# EAGLE design NodeMCU_watering_system (EAGLE 8.2.0)
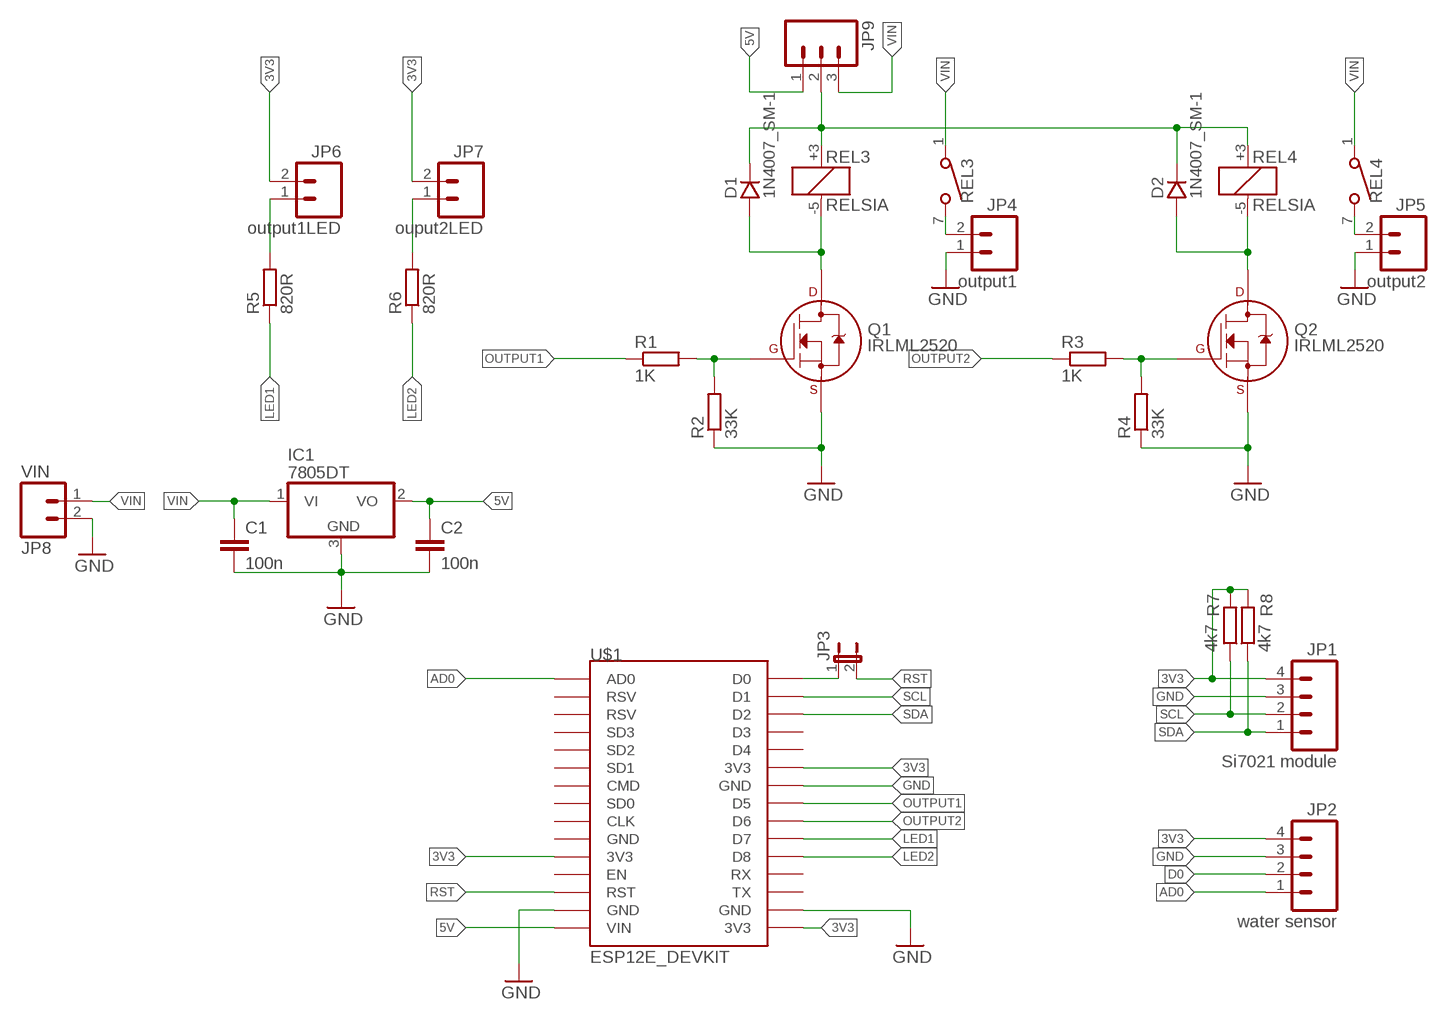
[diagram p0: schematic, sheet 1]

## Parts
C1  100n  C-EUC0805K  [C0805K]
C2  100n  C-EUC0805K  [C0805K]
D1  1N4007_SM-1  [SM-1]
D2  1N4007_SM-1  [SM-1]
IC1  7805DT  [TO252]
JP1  Si7021 module  M04LONGPADS  [1X04_LONGPADS]
JP2  water sensor  M04LONGPADS  [1X04_LONGPADS]
JP3  JP1E  [JP1]
JP4  output1  M02LOCK_LONGPADS  [1X02_LOCK_LONGPADS]
JP5  output2  M02LOCK_LONGPADS  [1X02_LOCK_LONGPADS]
JP6  output1LED  M02LOCK_LONGPADS  [1X02_LOCK_LONGPADS]
JP7  ouput2LED  M02LOCK_LONGPADS  [1X02_LOCK_LONGPADS]
JP8  VIN  M02LOCK_LONGPADS  [1X02_LOCK_LONGPADS]
JP9  M03LONGPADS  [1X03_LONGPADS]
Q1  IRLML2520  2N7002A_SOT23  [SOT-23]
Q2  IRLML2520  2N7002A_SOT23  [SOT-23]
R1  1K  R-EU_M0805  [M0805]
R2  33K  R-EU_M0805  [M0805]
R3  1K  R-EU_M0805  [M0805]
R4  33K  R-EU_M0805  [M0805]
R5  820R  R-EU_M0805  [M0805]
R6  820R  R-EU_M0805  [M0805]
R7  4k7  R-EU_M0805  [M0805]
R8  4k7  R-EU_M0805  [M0805]
REL3  RELSIA  [RELSIA]
REL4  RELSIA  [RELSIA]
U$1  ESP12E_DEVKIT  [ESP12E_DEVKIT]

## Nets
3V3: JP1.4 JP2.4 JP6.2 JP7.2 R7.2 R8.2 U$1.3V3@0(3V3) U$1.3V3@1(3V3) U$1.3V3@2(3V3)
5V: C2.1 IC1.2(VO) JP9.1 U$1.VIN
AD0: JP2.1 U$1.AD0
D0: JP2.2
GND: C1.2 C2.2 IC1.3(GND) JP1.3 JP2.3 JP4.1 JP5.1 JP8.2 Q1.2(S) Q2.2(S) R2.1 R4.1 U$1.GND@1(GND) U$1.GND@2(GND) U$1.GND@3(GND)
LED1: R5.1 U$1.D7
LED2: R6.1 U$1.D8
N$1: JP3.1 U$1.D0
N$2: Q1.1(G) R1.2 R2.2
N$3: Q2.1(G) R3.2 R4.2
N$4: D1.A Q1.3(D) REL3.-5(CIVKA:C-)
N$5: D2.A Q2.3(D) REL4.-5(CIVKA:C-)
N$6: JP4.2 REL3.7
N$7: JP5.2 REL4.7
N$8: JP6.1 R5.2
N$9: JP7.1 R6.2
N$10: D1.K D2.K JP9.2 REL3.+3(CIVKA:C+) REL4.+3(CIVKA:C+)
OUTPUT1: R1.1 U$1.D5
OUTPUT2: R3.1 U$1.D6
RST: JP3.2 U$1.RST
SCL: JP1.2 R7.1 U$1.D1
SDA: JP1.1 R8.1 U$1.D2
VIN: C1.1 IC1.1(VI) JP8.1 JP9.3 REL3.1 REL4.1
Unconnected: U$1.CLK U$1.CMD U$1.D3 U$1.D4 U$1.EN U$1.GND@0(GND) U$1.RSV@0(RSV) U$1.RSV@1(RSV) U$1.RX U$1.SD0 U$1.SD1 U$1.SD2 U$1.SD3 U$1.TX

## Library data of the parts
C1 C2 = rcl:C-EU: CAPACITOR, European symbol
D1 D2 = #PaJa_30:1N4007: Usmernovaci dioda - 1A, 1000V
IC1 = linear:78*: Positive VOLTAGE REGULATOR Source: http://cache.national.com/ds/LM/LM78L05.pdf http://www.fairchildsemi.com/ds/LM/LM7805.pdf
JP1 JP2 = SparkFun:M04: Header 4 Standard 4-pin 0.1" header. Use with straight break away headers (SKU : PRT-00116), right angle break away headers (PRT-00553), swiss pins (PRT-00743), machine pins (PRT-00117), and female headers (PRT-00115). Molex polarized connector foot print use with SKU : PRT-08231 with associated crimp pins and housings. 1MM SMD Version SKU: PRT-10208
JP3 = jumper:JP1E: JUMPER
JP4-JP8 = SparkFun:M02: Header 2 Standard 2-pin 0.1" header. Use with straight break away headers (SKU : PRT-00116), right angle break away headers (PRT-00553), swiss pins (PRT-00743), machine pins (PRT-00117), and female headers (PRT-00115). Molex polarized connector foot print use with SKU : PRT-08233 with associated crimp pins and housings.
JP9 = SparkFun:M03: Header 3 Standard 3-pin 0.1" header. Use with straight break away headers (SKU : PRT-00116), right angle break away headers (PRT-00553), swiss pins (PRT-00743), machine pins (PRT-00117), and female headers (PRT-00115). Molex polarized connector foot print use with SKU : PRT-08232 with associated crimp pins and housings.
Q1 Q2 = transistors:2N700*: 2N7000, 2N7002, NDS7002A N-channel enhancement mode MOSFET
R1-R8 = rcl:R-EU_: RESISTOR, European symbol
REL3 REL4 = #PaJa_22:RELSIA??: RELE - 1x spinaci, 5V, 12V, 24V max. spinany proud = 0,5A
U$1 = NodeMCU:ESP12E_DEVKIT: ESP12E DEVKIT BOARD

## Board
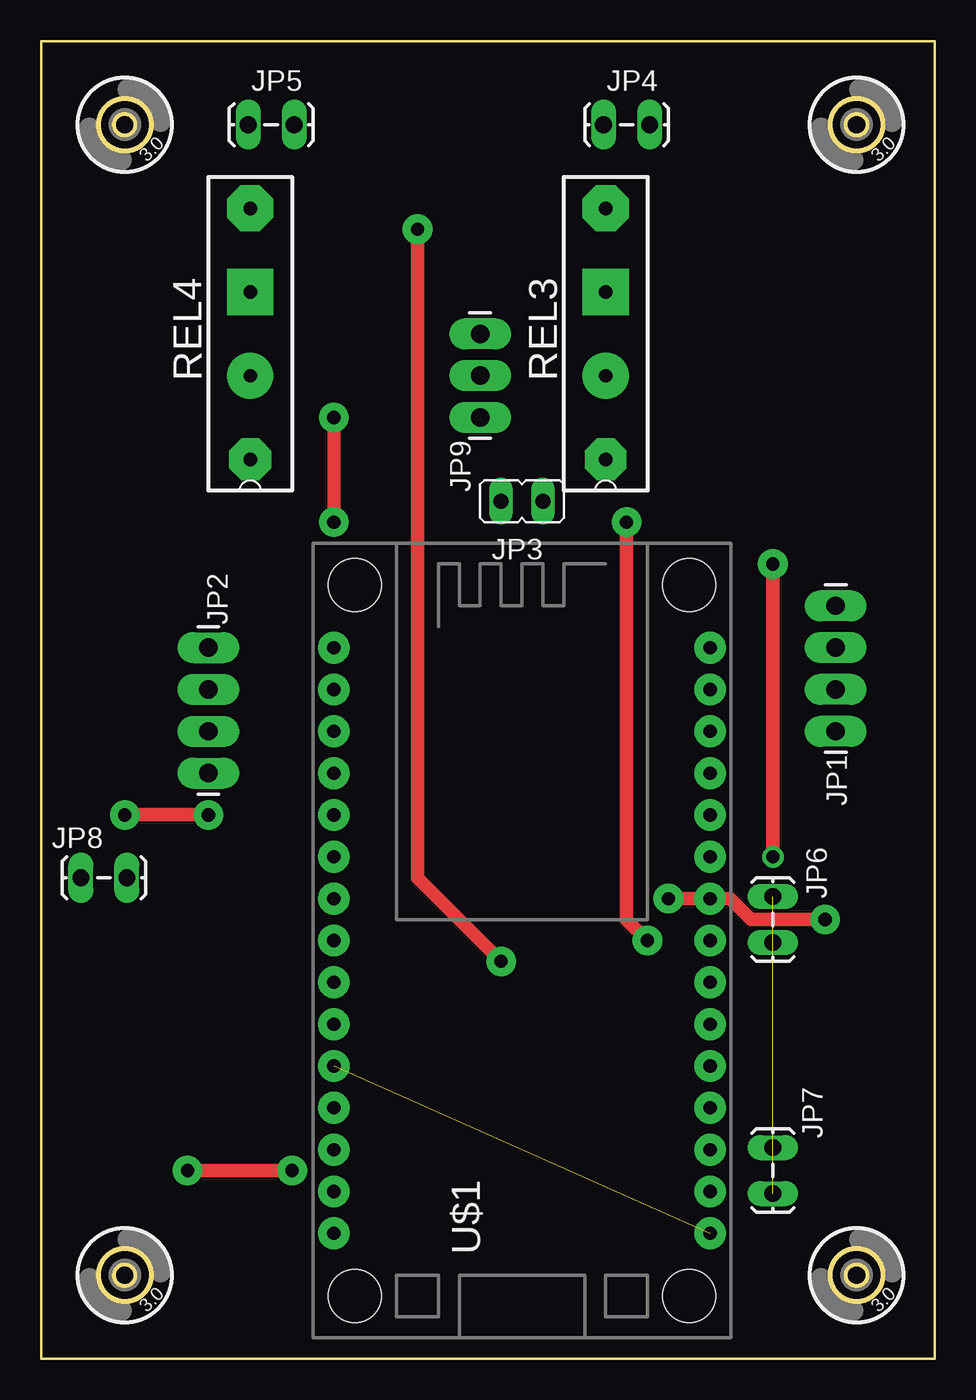
[diagram p1: board, top side]
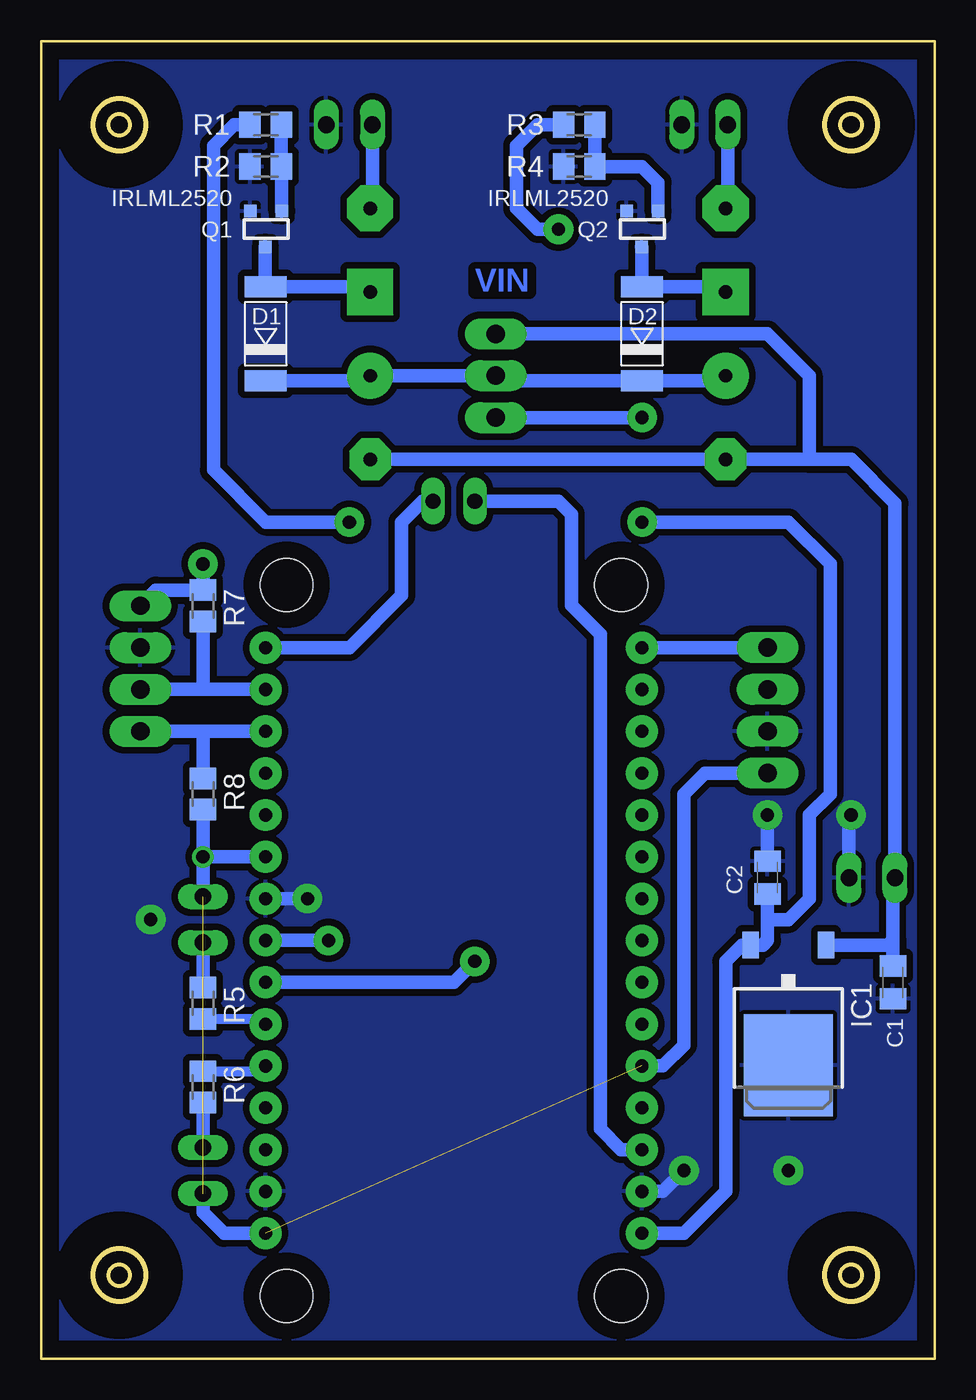
[diagram p2: board, bottom side, seen from below]

Size 54.28 x 80 mm. Coordinates in mm from the lower left corner, seen from the top.
Outline: 0,0 54.28,0 54.28,80 0,80 0,0
Copper layers (1*16): Top 0.035mm / dielectric 1.5mm / Bottom 0.035mm
Design rules "default": minimum track width 10mil, minimum drill 24mil, track to track 8mil, track to pad 8mil, pad to pad 8mil, via to via 8mil, smd to smd 8mil, copper to edge 40mil, drill to drill 8mil, minimum pad ring 10mil, minimum via ring 8mil, stop-mask expansion 4mil, vias tented up to drill 0mil, thermal gap 10mil

### Footprints (pad centres in the part's own frame; a part is rotated, then mirrored left to right if it is on the bottom)
C0805K = smd 1.3 x 1.6: 1 -1,0; 2 1,0
SM-1 = smd 1.27 x 2.54: A 2.857,0; K -2.857,0
TO252 = smd 1 x 1.6: 1 -2.28,-4.8; 2 2.28,-4.8 | smd 5.4 x 6.2: 3 0,2.5
1X04_LONGPADS = drill 1.118 pad 1.88 long: 1 0,0; 2 2.54,0; 3 5.08,0; 4 7.62,0
JP1 = drill 0.914 long: 1 0,-1.27; 2 0,1.27
1X02_LOCK_LONGPADS = drill 1.016 long: 1 -0.127,0; 2 2.667,0
1X03_LONGPADS = drill 1.118 pad 1.88 long: 1 0,0; 2 2.54,0; 3 5.08,0
SOT-23 = smd 0.762 x 0.762: 1 -0.979,-1.101; 2 0.94,-1.101; 3 0.025,1.067
M0805 = smd 1.3 x 1.6: 1 -0.95,0; 2 0.95,0
RELSIA = drill 0.813 pad 2.54 octagon: 1 -7.62,0 | drill 0.813 pad 2.8 octagon: 7 7.62,0 | drill 0.813 pad 2.8: +3 -2.54,0 | drill 0.813 pad 2.8 square: -5 2.54,0
ESP12E_DEVKIT = drill 0.8 pad 1.93: 3V3@0 -11.43,-7.62; 3V3@1 11.43,5.08; 3V3@2 11.43,-17.78; AD0 -11.43,17.78; CLK -11.43,-2.54; CMD -11.43,2.54; D0 11.43,17.78; D1 11.43,15.24; D2 11.43,12.7; D3 11.43,10.16; D4 11.43,7.62; D5 11.43,0; D6 11.43,-2.54; D7 11.43,-5.08; D8 11.43,-7.62; EN -11.43,-10.16; GND@0 -11.43,-5.08; GND@1 -11.43,-15.24; GND@2 11.43,2.54; GND@3 11.43,-15.24; RST -11.43,-12.7; RSV@0 -11.43,15.24; RSV@1 -11.43,12.7; RX 11.43,-10.16; SD0 -11.43,0; SD1 -11.43,5.08; SD2 -11.43,7.62; SD3 -11.43,10.16; TX 11.43,-12.7; VIN -11.43,-17.78 | hole 3.2: -10.16,21.59; 10.16,21.59; 10.16,-21.59; -10.16,-21.59
HOLE_3,0 = hole 3.2: 0,0

### Placement (x,y rotation side)
C1  2.54,22.86 270 bottom
C2  10.16,29.21 90 bottom
D1  40.64,62.23 90 bottom
D2  17.78,62.23 90 bottom
IC1  8.89,20.32 180 bottom
JP1  48.26,38.1 90 top
JP2  10.16,43.18 270 top
JP3  29.21,52.07 90 top
JP4  36.83,74.93 180 top
JP5  15.24,74.93 180 top
JP6  44.45,25.4 90 top
JP7  44.45,12.7 270 top
JP8  2.54,29.21 0 top
JP9  26.67,57.15 90 top
Q1  40.64,68.58 180 bottom
Q2  17.78,68.58 180 bottom
R1  40.64,74.93 0 bottom
R2  40.64,72.39 0 bottom
R3  21.59,74.93 0 bottom
R4  21.59,72.39 0 bottom
R5  44.45,21.59 90 bottom
R6  44.45,16.51 270 bottom
R7  44.45,45.72 90 bottom
R8  44.45,34.29 270 bottom
REL3  RELSIA?  [RELSIA]  34.29,62.23 90 top
REL4  RELSIA?  [RELSIA]  12.7,62.23 90 top
U$1  29.21,25.4 0 top
U$2  [HOLE_3,0]  5.08,5.08 0 top
U$3  [HOLE_3,0]  49.53,5.08 0 top
U$4  [HOLE_3,0]  5.08,74.93 0 top
U$5  [HOLE_3,0]  49.53,74.93 0 top

### Tracks (layer width: path | path; a pad name or v marks a point on that pad's centre or on a via)
3V3  (via drill 0.8 pad 1.3, 0.8 pad 1.8)  (2 unrouted)
  Top 0.813: v44.45,48.26 v44.45,30.48
  Bottom 0.813: U$1.3V3@0 16.51,17.78 15.24,19.05 15.24,34.29 13.97,35.56 JP2.4 | JP1.4 47.31,46.67 R7.2 v44.45,48.26 | v44.45,30.48 U$1.3V3@1 | JP6.2 v44.45,30.48 | R8.2 v44.45,30.48 | U$1.3V3@2 43.18,7.62 44.45,8.89 JP7.2
5V  (via drill 0.8 pad 1.8)
  Top 0.813: v17.78,50.8 v17.78,57.15
  Bottom 0.813: 10.16,26.67 10.16,25.4 10.44,25.12 IC1.2 11.71,25.12 12.7,24.13 12.7,10.16 15.24,7.62 U$1.VIN | 10.16,26.67 C2.1 | 10.16,26.67 8.89,26.67 7.62,27.94 7.62,33.02 6.35,34.29 6.35,48.26 8.89,50.8 v17.78,50.8 | v17.78,57.15 JP9.1
AD0
  Bottom 0.813: U$1.AD0 JP2.1
GND  (via drill 0.8 pad 1.8)
  Top 0.813: v15.24,11.43 v8.89,11.43 | v5.08,33.02 v10.16,33.02 | v38.1,27.94 41.88,27.94 43.12,26.7 47.6,26.7 v47.62,26.67
  Bottom 0.813: U$1.GND@1 16.51,10.16 v15.24,11.43 | JP8.2 5.21,32.89 v5.08,33.02 | v10.16,33.02 C2.2 | U$1.GND@2 v38.1,27.94
  pour Bottom (isolate 0.406): 0,80.01 54.61,80.01 54.61,0 0,0
LED1
  Bottom 0.61: R5.1 40.96,20.64 U$1.D7
LED2
  Bottom 0.61: R6.1 40.96,17.46 U$1.D8
N$1
  Bottom 0.813: JP3.1 31.11,52.07 32.38,50.8 32.38,46.35 35.56,43.18 U$1.D0
N$2
  Bottom 0.813: Q1.1 39.66,72.36 R2.2 R1.2
N$3
  Bottom 0.813: Q2.1 16.8,71.41 17.78,72.39 R4.2 R3.2
N$4
  Bottom 0.813: REL3.-5 34.61,65.09 D1.A 40.66,65.11 Q1.3
N$5
  Bottom 0.813: REL4.-5 13.02,65.09 D2.A 17.78,67.49 Q2.3
N$6
  Bottom 0.813: JP4.2 34.16,69.98 REL3.7
N$7
  Bottom 0.813: JP5.2 12.57,69.98 REL4.7
N$8
  Bottom 0.813: R5.2 JP6.1
N$9
  Bottom 0.813: R6.2 JP7.1
N$10
  Bottom 0.813: REL4.+3 13.02,59.37 D2.K 26.35,59.37 JP9.2 REL3.+3 34.61,59.37 D1.K
OUTPUT1  (via drill 0.8 pad 1.8)
  Top 0.813: v35.56,50.8 35.56,26.67 v36.83,25.4
  Bottom 0.813: 41.91,74.93 R1.1 42.55,74.93 43.81,73.66 43.81,53.98 40.64,50.8 v35.56,50.8 | v36.83,25.4 U$1.D5
OUTPUT2  (via drill 0.8 pad 1.8)
  Top 0.813: v27.94,24.13 22.86,29.21 v22.86,68.58
  Bottom 0.813: U$1.D6 29.21,22.86 v27.94,24.13 | v22.86,68.58 24.13,68.58 25.4,69.85 25.4,73.66 24.13,74.93 R3.1
RST
  Bottom 0.813: U$1.RST 19.05,12.7 20.32,13.97 20.32,43.99 22.07,45.74 22.07,51.28 22.86,52.07 JP3.2
SCL
  Bottom 0.813: 44.45,40.64 JP1.2 | 44.45,40.64 U$1.D1 | R7.1 44.45,40.64
SDA
  Bottom 0.813: 44.45,38.1 JP1.1 | 44.45,38.1 U$1.D2 | R8.1 44.45,38.1
VIN
  Bottom 0.813: REL3.1 REL4.1 7.62,54.61 | 2.54,25.4 C1.1 | 2.54,25.4 2.54,29.08 JP8.1 2.41,51.94 5.08,54.61 7.62,54.61 | IC1.1 2.82,25.12 2.54,25.4 | JP9.3 10.16,62.23 7.62,59.69 7.62,54.61

### Text on the board
Bottom: VIN